# Altium schematic sheet DriverForDisplayV2.SchDoc
size A; SheetNumber: 1; SheetTotal: 2
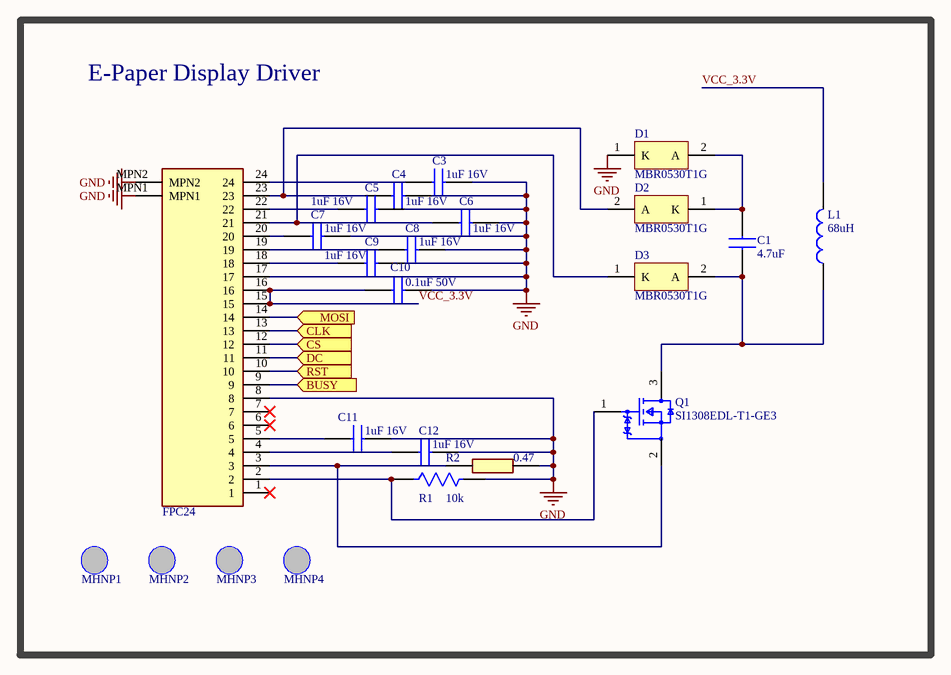
[diagram p0: DriverForDisplayV2.SchDoc]

## Parts
C1  4.7uF  [CAPC1608X90N]
C3  1uF 16V  [CAPC1608X90N]
C4  1uF 16V  [CAPC1608X90N]
C5  1uF 16V  [CAPC1608X90N]
C6  1uF 16V  [CAPC1608X90N]
C7  1uF 16V  [CAPC1608X90N]
C8  1uF 16V  [CAPC1608X90N]
C9  1uF 16V  [CAPC1608X90N]
C10  0.1uF 50V  [CAPC1608X90N]
C11  1uF 16V  [CAPC1608X90N]
C12  1uF 16V  [CAPC1608X90N]
D1  MBR0530T1G  [ONSC-SOD-123-2-425-04_V]
D2  MBR0530T1G  [ONSC-SOD-123-2-425-04_V]
D3  MBR0530T1G  [ONSC-SOD-123-2-425-04_V]
J2  FPC24  [FH34SRJ24S05SH50]
L1  68uH  [INDC2012X145N]
MHNP1  CMP-011-000000-1  [MTHNP3P2MM]  (value not drawn)
MHNP2  CMP-011-000000-1  [MTHNP3P2MM]  (value not drawn)
MHNP3  CMP-011-000000-1  [MTHNP3P2MM]  (value not drawn)
MHNP4  CMP-011-000000-1  [MTHNP3P2MM]  (value not drawn)
Q1  SI1308EDL-T1-GE3  [FP-5549-MFG]
R1  10k  [FP-RC1608-MFG]
R2  0.47  [RESC1608X55N]

## Blocks framed on the sheet
E-Paper Display Driver: C1 C3-C12 D1-D3 J2 L1 MHNP1-MHNP4 Q1 R1 R2

## Ports
BUSY (in, see CustomESP32[1C]), CLK (in, see CustomESP32[1C]), CS (in, see CustomESP32[1C]), DC (in, see CustomESP32[1C]), MOSI (in, see CustomESP32[1C]), RST (in, see CustomESP32[1C])

## Nets
GND: C3.2 C4.2 C5.2 C6.2 C7.2 C8.2 C9.2 C10.2 C11.2 C12.2 D1.1(K) J2.8 J2.17 J2.MPN1 J2.MPN2 R1.2 R2.2
BUSY: J2.9 ; port BUSY
CLK: J2.13 ; port CLK
CS: J2.12 ; port CS
DC: J2.11 ; port DC
MOSI: J2.14 ; port MOSI
RST: J2.10 ; port RST
VCC_3.3V: C10.1 J2.15 J2.16 L1.2
NetC1_1: C1.1 D3.2(A) L1.1 Q1.3(D)
NetC1_2: C1.2 D1.2(A) D2.1(K)
NetC3_1: C3.1 J2.24
NetC4_1: C4.1 D2.2(A) J2.23
NetC5_1: C5.1 J2.22
NetC6_1: C6.1 D3.1(K) J2.21
NetC7_1: C7.1 J2.20
NetC8_1: C8.1 J2.19
NetC9_1: C9.1 J2.18
NetC11_1: C11.1 J2.5
NetC12_1: C12.1 J2.4
NetJ2_2: J2.2 Q1.1(G) R1.1
NetJ2_3: J2.3 Q1.2(S) R2.1

Not connected (* = marked no-connect by the designer): J2 1* 6* 7*

## Library data of the parts
C1 = CL10A475KO8NNNC: Capacitor; Manufacturer_Name: SAMSUNG; Datasheet Link: https://rs.componentsearchengine.com/Datasheets/2/CL10A475KO8NNNC.pdf; Height: 0.9mm; Manufacturer_Part_Number: CL10A475KO8NNNC; Mouser Part Number: 187-CL10A475KO8NNNC; Mouser Price/Stock: https://www.mouser.co.uk/ProductDetail/Samsung-Electro-Mechanics/CL10A475KO8NNNC?qs=X6jEic%2FHinAbIjmLnFfqqQ%3D%3D; Arrow Part Number: CL10A475KO8NNNC; Arrow Price/Stock: https://www.arrow.com/en/products/cl10a475ko8nnnc/samsung-electro-mechanics?utm_currency=USD&region=europe
C3-C9 C11 C12 = CL10A105KO8NNNC: Samsung Electro-Mechanics 0603 CL 1μF Ceramic Multilayer Capacitor, 16 V, +85°C, X5R Dielectric, ±10% SMD; Height: 0.9mm; Datasheet Link: https://labcenter.componentsearchengine.com/Datasheets/2/CL10A105KO8NNNC.pdf; Manufacturer_Name: SAMSUNG; Manufacturer_Part_Number: CL10A105KO8NNNC; Mouser Part Number: 187-CL10A105KO8NNNC; Mouser Price/Stock: https://www.mouser.co.uk/ProductDetail/Samsung-Electro-Mechanics/CL10A105KO8NNNC?qs=hqM3L16%252BxlfR4qamq4FMLg%3D%3D; Arrow Part Number: CL10A105KO8NNNC; Arrow Price/Stock: https://www.arrow.com/en/products/cl10a105ko8nnnc/samsung-electro-mechanics?region=nac
C10 = CL10A105KO8NNNC: Ceramic SMT capacitor 100nF 50Vdc Murata 0603 GRM 100nF Ceramic Multilayer Capacitor, 50 V dc, +125?C, X7R Dielectric, ?10%; Manufacturer_Name: SAMSUNG; Datasheet Link: https://labcenter.componentsearchengine.com/Datasheets/2/CL10A105KO8NNNC.pdf; Height: 0.9mm; Manufacturer_Part_Number: CL10A105KO8NNNC; Mouser Part Number: 187-CL10A105KO8NNNC; Mouser Price/Stock: https://www.mouser.co.uk/ProductDetail/Samsung-Electro-Mechanics/CL10A105KO8NNNC?qs=hqM3L16%252BxlfR4qamq4FMLg%3D%3D; Arrow Part Number: CL10A105KO8NNNC; Arrow Price/Stock: https://www.arrow.com/en/products/cl10a105ko8nnnc/samsung-electro-mechanics?region=nac
D1-D3 = CMP-1055-00413-1: Schottky Power Rectifier, 2-Pin SOD-123, Pb-Free, Tape and Reel A for Anode K for Cathode (triangle points to cathode); Manufacturer: On Semiconductor; IFSM Max (A): 5.5; Configuration: Single; PackageVersion: Rev. G, 10/2009; ComponentLink2URL: http://www.onsemi.cn/pub_link/Collateral/MBR0530T1-D.PDF; Packing: Tape and Reel; RoHS: TRUE; ComponentLink1URL: http://www.onsemi.com/; Mounting Technology: Surface Mount; ComponentLink3URL: http://www.onsemi.com/pub_link/Collateral/425-04.PDF; ComponentLink3Description: Package Specification; PartNumber: MBR0530T1G; PackageDescription: 2-Pin SOD, Body 1.6 x 2.69 mm; DatasheetVersion: Rev. 7; PackageReference: SOD-123-2-425-04; ComponentLink1Description: Manufacturer URL; ComponentLink2Description: Datasheet
J2 = FH34SRJ-24S-0.5SH_50_: Connector; Manufacturer_Name: Hirose; Manufacturer_Part_Number: FH34SRJ-24S-0.5SH(50); Datasheet Link: https://datasheet.datasheetarchive.com/originals/distributors/DKDS-30/592742.pdf; Height: 1.75mm; Mouser Part Number: 798-FH34SRJ24S05SH50; Mouser Price/Stock: https://www.mouser.co.uk/ProductDetail/Hirose-Connector/FH34SRJ-24S-0.5SH50?qs=iyLo5FA4poC8fzWlavnA7A%3D%3D
L1 = MLF2012C680KT000: Inductor; Manufacturer_Name: TDK; Datasheet Link: https://product.tdk.com/system/files/dam/doc/product/inductor/inductor/smd/catalog/inductor_commercial_standard_mlf2012_en.pdf; Height: 1.45mm; Manufacturer_Part_Number: MLF2012C680KT000; Mouser Part Number: 810-MLF2012C680KT000; Mouser Price/Stock: https://www.mouser.com/Search/Refine.aspx?Keyword=810-MLF2012C680KT000; Arrow Part Number: MLF2012C680KT000; Arrow Price/Stock: https://www.arrow.com/en/products/mlf2012c680kt000/tdk?region=nac
MHNP1-MHNP4 = CMP-011-000000-1: Mounting Hole Non-Plated 3.2 mm drill hole; Manufacturer: N/A; Manufacturer Part Number: N/A; Source: LiPoBattery_A.SCHLIB; Design Item ID: MTHNP3P2MM
Q1 = CMP-02550-000099-2: MOSFET N-CH 30V 1.4A SC-70-3; Fall Time: 8ns; Max Power Dissipation: 500mW; Rise Time: 9ns; Rds On Max: 132mR; Power Dissipation: 400mW; Polarity: N-CHANNEL; Number of Elements: 1; Element Configuration: Single; Threshold Voltage: 600mV; Continuous Drain Current (ID): 1.5A; Gate to Source Voltage (Vgs): 12V; Turn-On Delay Time: 2ns; Input Capacitance: 105pF; Package Quantity: 3000; REACH SVHC: No SVHC; Mount: Surface Mount; Packaging: Tape and Reel; On-State Resistance: 132mR; Drain-source On Resistance-Max: 132mR; Lead Free: Lead Free; Drain to Source Breakdown Voltage: 30V; Series: TrenchFET®; Max Operating Temperature: 150°C; Drain to Source Resistance: 132mR; Radiation Hardening: No; Length: 2.2mm; Min Operating Temperature: -55°C; Number of Channels: 1; Drain to Source Voltage (Vdss): 30V; Number of Pins: 3; Turn-Off Delay Time: 8ns; Weight: 0.004395oz; RoHS Compliant: Yes; Width: 1.35mm; Height: 1mm; Case/Package: SOT-323
R1 = CMP-13261-001097-1: Res Thick Film 0603 10kΩ 1% 0.1W ±100ppm/°C Molded SMD T/R; Power Rating: 100mW; Resistance: 10kR; Max Operating Temperature: 155°C; Radiation Hardening: No; Tolerance: 1%; Case/Package: 0603; Case Code (Metric): 1608; Composition: Thick Film; Max Power Dissipation: 100mW; Number of Terminations: 2; Temperature Coefficient: 100ppm/°C; Contact Plating: Tin; Packaging: Tape and Reel; Features: Moisture Resistant; Case Code (Imperial): 0603; Width: 0.031inch; Length: 0.063inch; Military Standard: Not; Depth: 0.8mm; Height: 0.022inch; Min Operating Temperature: -55°C
R2 = RMCF0603JTR470: RES, 0603, 0.47 ohm, 5%, 0.1W; Manufacturer_Name: Stackpole Electronics; Datasheet Link: https://www.seielect.com/Catalog/SEI-RMCF_RMCP.pdf; Height: 0.55mm; Manufacturer_Part_Number: RMCF0603JTR470